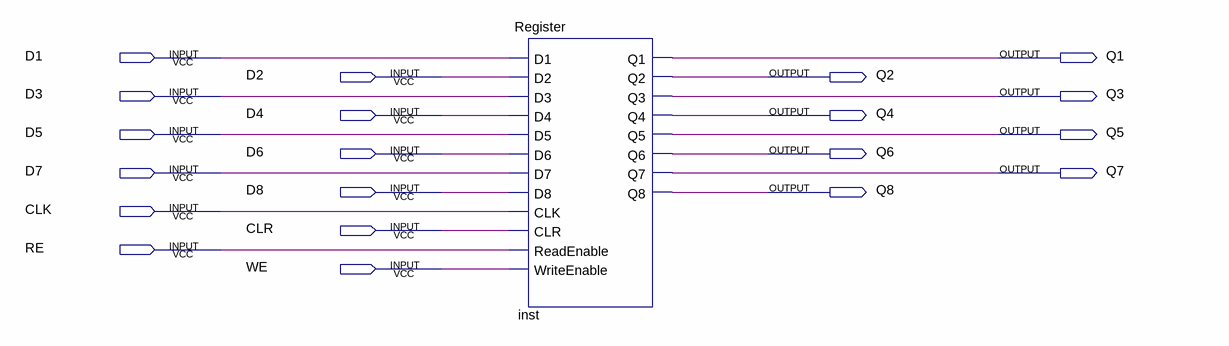
[diagram p0: schematic sheet]
// Quartus schematic 8bitComputerRegisterTest.bdf as structural Verilog: 1 symbols, 20 pins
module \8bitComputerRegisterTest  (
  input  D1,
  input  D2,
  input  D3,
  input  D4,
  input  D5,
  input  D6,
  input  D7,
  input  D8,
  input  CLK,
  input  CLR,
  input  RE,
  input  WE,
  output Q1,
  output Q2,
  output Q3,
  output Q4,
  output Q5,
  output Q6,
  output Q7,
  output Q8
);

  Register inst (
    .D1(D1), .D2(D2), .D3(D3), .D4(D4), .D5(D5), .D6(D6), .D7(D7), .D8(D8), .CLK(CLK), .CLR(CLR),
    .ReadEnable(RE), .WriteEnable(WE), .Q1(Q1), .Q2(Q2), .Q3(Q3), .Q4(Q4), .Q5(Q5), .Q6(Q6), .Q7(Q7), .Q8(Q8));
endmodule
